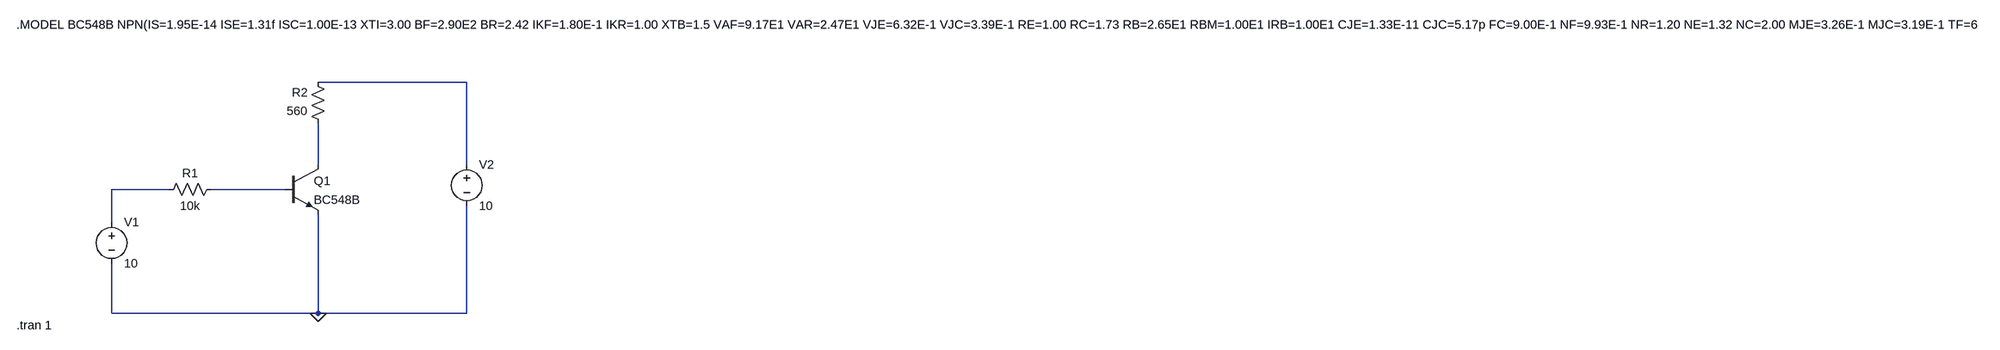
[diagram p0: schematic curva_caract.asc]
curva_caract.asc, the LTspice schematic file:
Version 4.1
SHEET 1 5052 680
WIRE 704 -160 416 -160
WIRE 416 0 416 -80
WIRE 704 0 704 -160
WIRE 128 48 16 48
WIRE 352 48 208 48
WIRE 16 112 16 48
WIRE 16 288 16 192
WIRE 416 288 416 96
WIRE 416 288 16 288
WIRE 704 288 704 80
WIRE 704 288 416 288
FLAG 416 288 0
SYMBOL voltage 16 96 R0
SYMATTR InstName V1
SYMATTR Value 10
SYMBOL res 224 32 R90
WINDOW 0 0 56 VBottom 2
WINDOW 3 32 56 VTop 2
SYMATTR InstName R1
SYMATTR Value 10k
SYMBOL res 432 -64 R180
WINDOW 0 36 76 Left 2
WINDOW 3 36 40 Left 2
SYMATTR InstName R2
SYMATTR Value 560
SYMBOL voltage 704 -16 R0
SYMATTR InstName V2
SYMATTR Value 10
SYMBOL npn 352 0 R0
SYMATTR InstName Q1
SYMATTR Value BC548B
TEXT -168 -272 Left 2 !.MODEL BC548B NPN(IS=1.95E-14 ISE=1.31f ISC=1.00E-13 XTI=3.00 BF=2.90E2 BR=2.42 IKF=1.80E-1 IKR=1.00 XTB=1.5 VAF=9.17E1 VAR=2.47E1 VJE=6.32E-1 VJC=3.39E-1 RE=1.00 RC=1.73 RB=2.65E1 RBM=1.00E1 IRB=1.00E1 CJE=1.33E-11 CJC=5.17p FC=9.00E-1 NF=9.93E-1 NR=1.20 NE=1.32 NC=2.00 MJE=3.26E-1 MJC=3.19E-1 TF=6.52E-10 TR=0 ITF=1.03 VTF=1.65 XTF=1.00E2 EG=1.11 VCEO=30 ICRATING=100m MFG=PHILIPS)
TEXT -168 312 Left 2 !.tran 1

The netlist it stands for:
* curva_caract.asc
V1 N003 0 10
R1 N004 N003 10k
R2 N002 N001 560
V2 N001 0 10
Q1 N002 N004 0 0 BC548B
.model NPN NPN
.model PNP PNP
.lib standard.bjt
.MODEL BC548B NPN(IS=1.95E-14 ISE=1.31f ISC=1.00E-13 XTI=3.00 BF=2.90E2 BR=2.42 IKF=1.80E-1 IKR=1.00 XTB=1.5 VAF=9.17E1 VAR=2.47E1 VJE=6.32E-1 VJC=3.39E-1 RE=1.00 RC=1.73 RB=2.65E1 RBM=1.00E1 IRB=1.00E1 CJE=1.33E-11 CJC=5.17p FC=9.00E-1 NF=9.93E-1 NR=1.20 NE=1.32 NC=2.00 MJE=3.26E-1 MJC=3.19E-1 TF=6.52E-10 TR=0 ITF=1.03 VTF=1.65 XTF=1.00E2 EG=1.11 VCEO=30 ICRATING=100m MFG=PHILIPS)
.tran 1
.backanno
.end